# EAGLE design Challenger-2040 (EAGLE 9.6.2)
COMPANY: Invector Labs; DRAWN: P. Oldberg; DRGNO: 10/98-00168-1; REV: 0.2

## Sheet 1 of 2
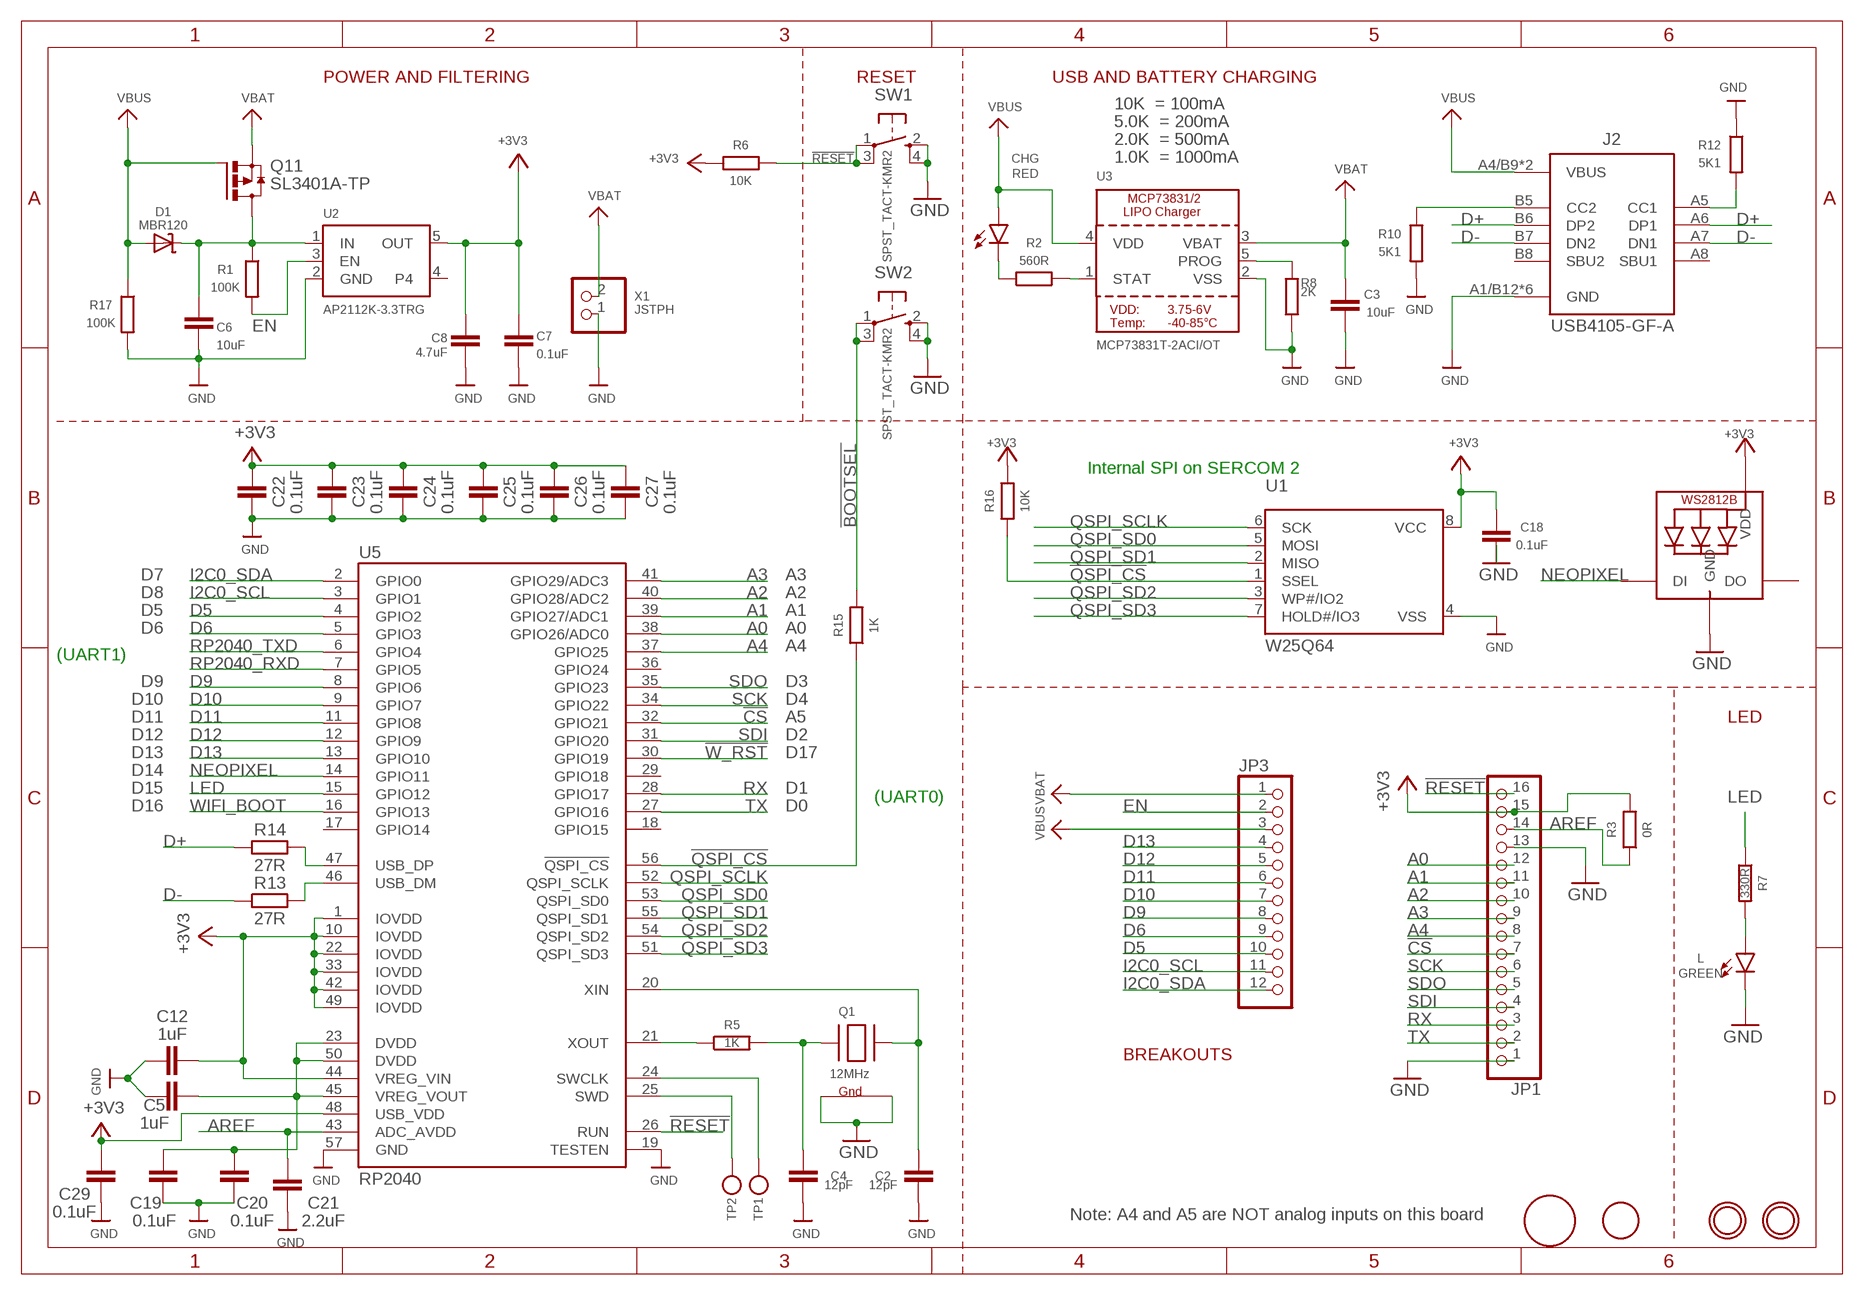
[diagram p0: schematic, sheet 1]

### Parts
C2  12pF  C_CHIP-0402(1005-METRIC)  [CAPC1005X60]
C3  10uF  C_CHIP-0603(1608-METRIC)  [CAPC1608X85]
C4  12pF  C_CHIP-0402(1005-METRIC)  [CAPC1005X60]
C5  1uF  C_CHIP-0402(1005-METRIC)  [CAPC1005X60]
C6  10uF  C_CHIP-0603(1608-METRIC)  [CAPC1608X85]
C7  0.1uF  C_CHIP-0402(1005-METRIC)  [CAPC1005X60]
C8  4.7uF  C_CHIP-0402(1005-METRIC)  [CAPC1005X60]
C12  1uF  C_CHIP-0402(1005-METRIC)  [CAPC1005X60]
C18  0.1uF  C_CHIP-0402(1005-METRIC)  [CAPC1005X60]
C19  0.1uF  C_CHIP-0402(1005-METRIC)  [CAPC1005X60]
C20  0.1uF  C_CHIP-0402(1005-METRIC)  [CAPC1005X60]
C21  2.2uF  C_CHIP-0402(1005-METRIC)  [CAPC1005X60]
C22  0.1uF  C_CHIP-0402(1005-METRIC)  [CAPC1005X60]
C23  0.1uF  C_CHIP-0402(1005-METRIC)  [CAPC1005X60]
C24  0.1uF  C_CHIP-0402(1005-METRIC)  [CAPC1005X60]
C25  0.1uF  C_CHIP-0402(1005-METRIC)  [CAPC1005X60]
C26  0.1uF  C_CHIP-0402(1005-METRIC)  [CAPC1005X60]
C27  0.1uF  C_CHIP-0402(1005-METRIC)  [CAPC1005X60]
C29  0.1uF  C_CHIP-0402(1005-METRIC)  [CAPC1005X60]
CHG  RED  LEDCHIPLED_0603  [CHIPLED_0603]
D1  MBR120  DIODE-SCHOTTKYSOD-123  [SOD-123]
J2  USB4105-GF-A  [GCT_USB4105-GF-A]
JP1  HEADER-1X16ROUND  [1X16_ROUND]
JP3  HEADER-1X12  [1X12_ROUND]
L  GREEN  LEDCHIPLED_0603  [CHIPLED_0603]
LED1  SK6812MINI-B  WS2812B3535  [LED3535]
LOGO1  CHALENGER-11MM  [CHALLENGER]
Q1  12MHz  XTAL-4-3225  [NX3225]
Q11  SL3401A-TP  FDN360P  [SUPER-SOT3]
R1  100K  R_CHIP-0402(1005-METRIC)  [RESC1005X40]
R2  560R  R_CHIP-0402(1005-METRIC)  [RESC1005X40]
R3  0R  R_CHIP-0402(1005-METRIC)  [RESC1005X40]
R5  1K  R_CHIP-0402(1005-METRIC)  [RESC1005X40]
R6  10K  R_CHIP-0402(1005-METRIC)  [RESC1005X40]
R7  330R  R_CHIP-0402(1005-METRIC)  [RESC1005X40]
R8  2K  R_CHIP-0402(1005-METRIC)  [RESC1005X40]
R10  5K1  R_CHIP-0402(1005-METRIC)  [RESC1005X40]
R12  5K1  R_CHIP-0402(1005-METRIC)  [RESC1005X40]
R13  27R  R_CHIP-0402(1005-METRIC)  [RESC1005X40]
R14  27R  R_CHIP-0402(1005-METRIC)  [RESC1005X40]
R15  1K  R_CHIP-0402(1005-METRIC)  [RESC1005X40]
R16  10K  R_CHIP-0402(1005-METRIC)  [RESC1005X40]
R17  100K  R_CHIP-0402(1005-METRIC)  [RESC1005X40]
SW1  SPST_TACT-KMR2  [KMR2]
SW2  SPST_TACT-KMR2  [KMR2]
TP1  TESTPOINTROUND1.5MM  [TESTPOINT_ROUND_1.5MM]
TP2  TESTPOINTROUND1.5MM  [TESTPOINT_ROUND_1.5MM]
U1  W25Q64  SPIFLASH_SOIC8208MIL  [SOIC8_208MIL]
U2  AP2112K-3.3TRG  VREG_SOT23-5  [SOT23-5]
U3  MCP73831T-2ACI/OT  MCP73831/2  [SOT23-5]
U5  RP2040  [QFN40P700X700X90-57T310N]
U$11  CHAL-TEXT  [CHAL-TEXT]
U$31  MOUNTINGHOLE2.5  [MOUNTINGHOLE_2.5_PLATED]
U$32  MOUNTINGHOLE2.5  [MOUNTINGHOLE_2.5_PLATED]
X1  JSTPH  CON_JST_PH_2PIN  [JSTPH2]

### Nets
!BOOTSEL: R15.2 SW2.1(P) SW2.3(P1)
!CS: JP1.7 U5.32(GPIO21)
!QSPI_CS: R15.1 R16.2 U1.1(SSEL) U5.56(!QSPI_CS)
!RESET: JP1.16 R6.1 SW1.1(P) SW1.3(P1) U5.26(RUN)
!W_RST: U5.30(GPIO19) ; also sheet 2
+3V3: C7.1 C8.1 C12.2 C18.1 C22.2 C23.2 C24.2 C25.2 C26.2 C27.2 C29.2 JP1.15 LED1.2(VDD) R3.2 R6.2 R16.1 U1.8(VCC) U2.5(OUT) U5.1(IOVDD) U5.10(IOVDD) U5.22(IOVDD) U5.33(IOVDD) U5.42(IOVDD) U5.44(VREG_VIN) U5.48(USB_VDD) U5.49(IOVDD) ; also sheet 2
A0: JP1.12 U5.38(GPIO26/ADC0)
A1: JP1.11 U5.39(GPIO27/ADC1)
A2: JP1.10 U5.40(GPIO28/ADC2)
A3: JP1.9 U5.41(GPIO29/ADC3)
A4: JP1.8 U5.37(GPIO25)
AREF: C21.2 JP1.14 R3.1 U5.43(ADC_AVDD)
D5: JP3.10 U5.4(GPIO2)
D6: JP3.9 U5.5(GPIO3)
D9: JP3.8 U5.8(GPIO6)
D10: JP3.7 U5.9(GPIO7)
D11: JP3.6 U5.11(GPIO8)
D12: JP3.5 U5.12(GPIO9)
D13: JP3.4 U5.13(GPIO10)
D+: J2.A6(DP1) J2.B6(DP2) R14.1
D-: J2.A7(DN1) J2.B7(DN2) R13.1
EN: JP3.2 R1.2 U2.3(EN)
GND: C2.2 C3.2 C4.2 C5.1 C6.2 C7.2 C8.2 C12.1 C18.2 C19.1 C20.1 C21.1 C22.1 C23.1 C24.1 C25.1 C26.1 C27.1 C29.1 J2.A1/B12(GND) J2.B1/A12(GND) J2.G1(GND) J2.G2(GND) J2.G3(GND) J2.G4(GND) JP1.1 JP1.13 L.C LED1.4(GND) Q1.2(G2) Q1.4(G1) R8.2 R10.2 R12.1 R17.2 SW1.2(S) SW1.4(S1) SW2.2(S) SW2.4(S1) U1.4(VSS) U2.2(GND) U3.2(VSS) U5.19(TESTEN) U5.57(GND) X1.1 ; also sheet 2
I2C0_SCL: JP3.11 U5.3(GPIO1)
I2C0_SDA: JP3.12 U5.2(GPIO0)
LED: R7.1 U5.15(GPIO12)
N$1: CHG.C R2.1
N$2: L.A R7.2
N$3: R2.2 U3.1(STAT)
N$4: R8.1 U3.5(PROG)
N$5: R13.2 U5.46(USB_DM)
N$7: R14.2 U5.47(USB_DP)
N$11: J2.B5(CC2) R10.1
N$12: J2.A5(CC1) R12.2
N$13: C2.1 Q1.3(X2) U5.20(XIN)
N$14: TP1.P$1 U5.24(SWCLK)
N$15: TP2.P$1 U5.25(SWD)
N$16: C4.1 Q1.1(X1) R5.2
N$17: R5.1 U5.21(XOUT)
N$18: C5.2 C19.2 C20.2 U5.23(DVDD) U5.45(VREG_VOUT) U5.50(DVDD)
N$20: C6.1 D1.C Q11.3(D) R1.1 U2.1(IN)
NEOPIXEL: LED1.1(DI) U5.14(GPIO11)
QSPI_SCLK: U1.6(SCK) U5.52(QSPI_SCLK)
QSPI_SD0: U1.5(MOSI) U5.53(QSPI_SD0)
QSPI_SD1: U1.2(MISO) U5.55(QSPI_SD1)
QSPI_SD2: U1.3(WP#/IO2) U5.54(QSPI_SD2)
QSPI_SD3: U1.7(HOLD#/IO3) U5.51(QSPI_SD3)
RP2040_RXD: U5.7(GPIO5) ; also sheet 2
RP2040_TXD: U5.6(GPIO4) ; also sheet 2
RX: JP1.3 U5.28(GPIO17)
SCK: JP1.6 U5.34(GPIO22)
SDI: JP1.4 U5.31(GPIO20)
SDO: JP1.5 U5.35(GPIO23)
TX: JP1.2 U5.27(GPIO16)
VBAT: C3.1 JP3.1 Q11.2(S) U3.3(VBAT) X1.2
VBUS: CHG.A D1.A J2.A4/B9(VBUS) J2.B4/A9(VBUS) JP3.3 Q11.1(G) R17.1 U3.4(VDD)
WIFI_BOOT: U5.16(GPIO13) ; also sheet 2
Unconnected: J2.A8(SBU1) J2.B8(SBU2) LED1.3(DO) U2.4 U5.17(GPIO14) U5.18(GPIO15) U5.29(GPIO18) U5.36(GPIO24)

### Notes on the sheet
- POWER AND FILTERING | RESET | USB AND BATTERY CHARGING
- 10K  = 100mA
- 5.0K  = 200mA
- 2.0K  = 500mA
- 1.0K  = 1000mA
- Internal SPI on SERCOM 2
- D7 | A3
- D8 | A2
- D5 | A1
- D6 | A0
- A4
- (UART1)
- D9 | D3
- D10 | D4
- D11 | A5 | LED
- D12 | D2
- D13 | D17
- D14
- D15 | D1
- (UART0)
- D16 | D0
- BREAKOUTS
- Note: A4 and A5 are NOT analog inputs on this board

## Sheet 2 of 2
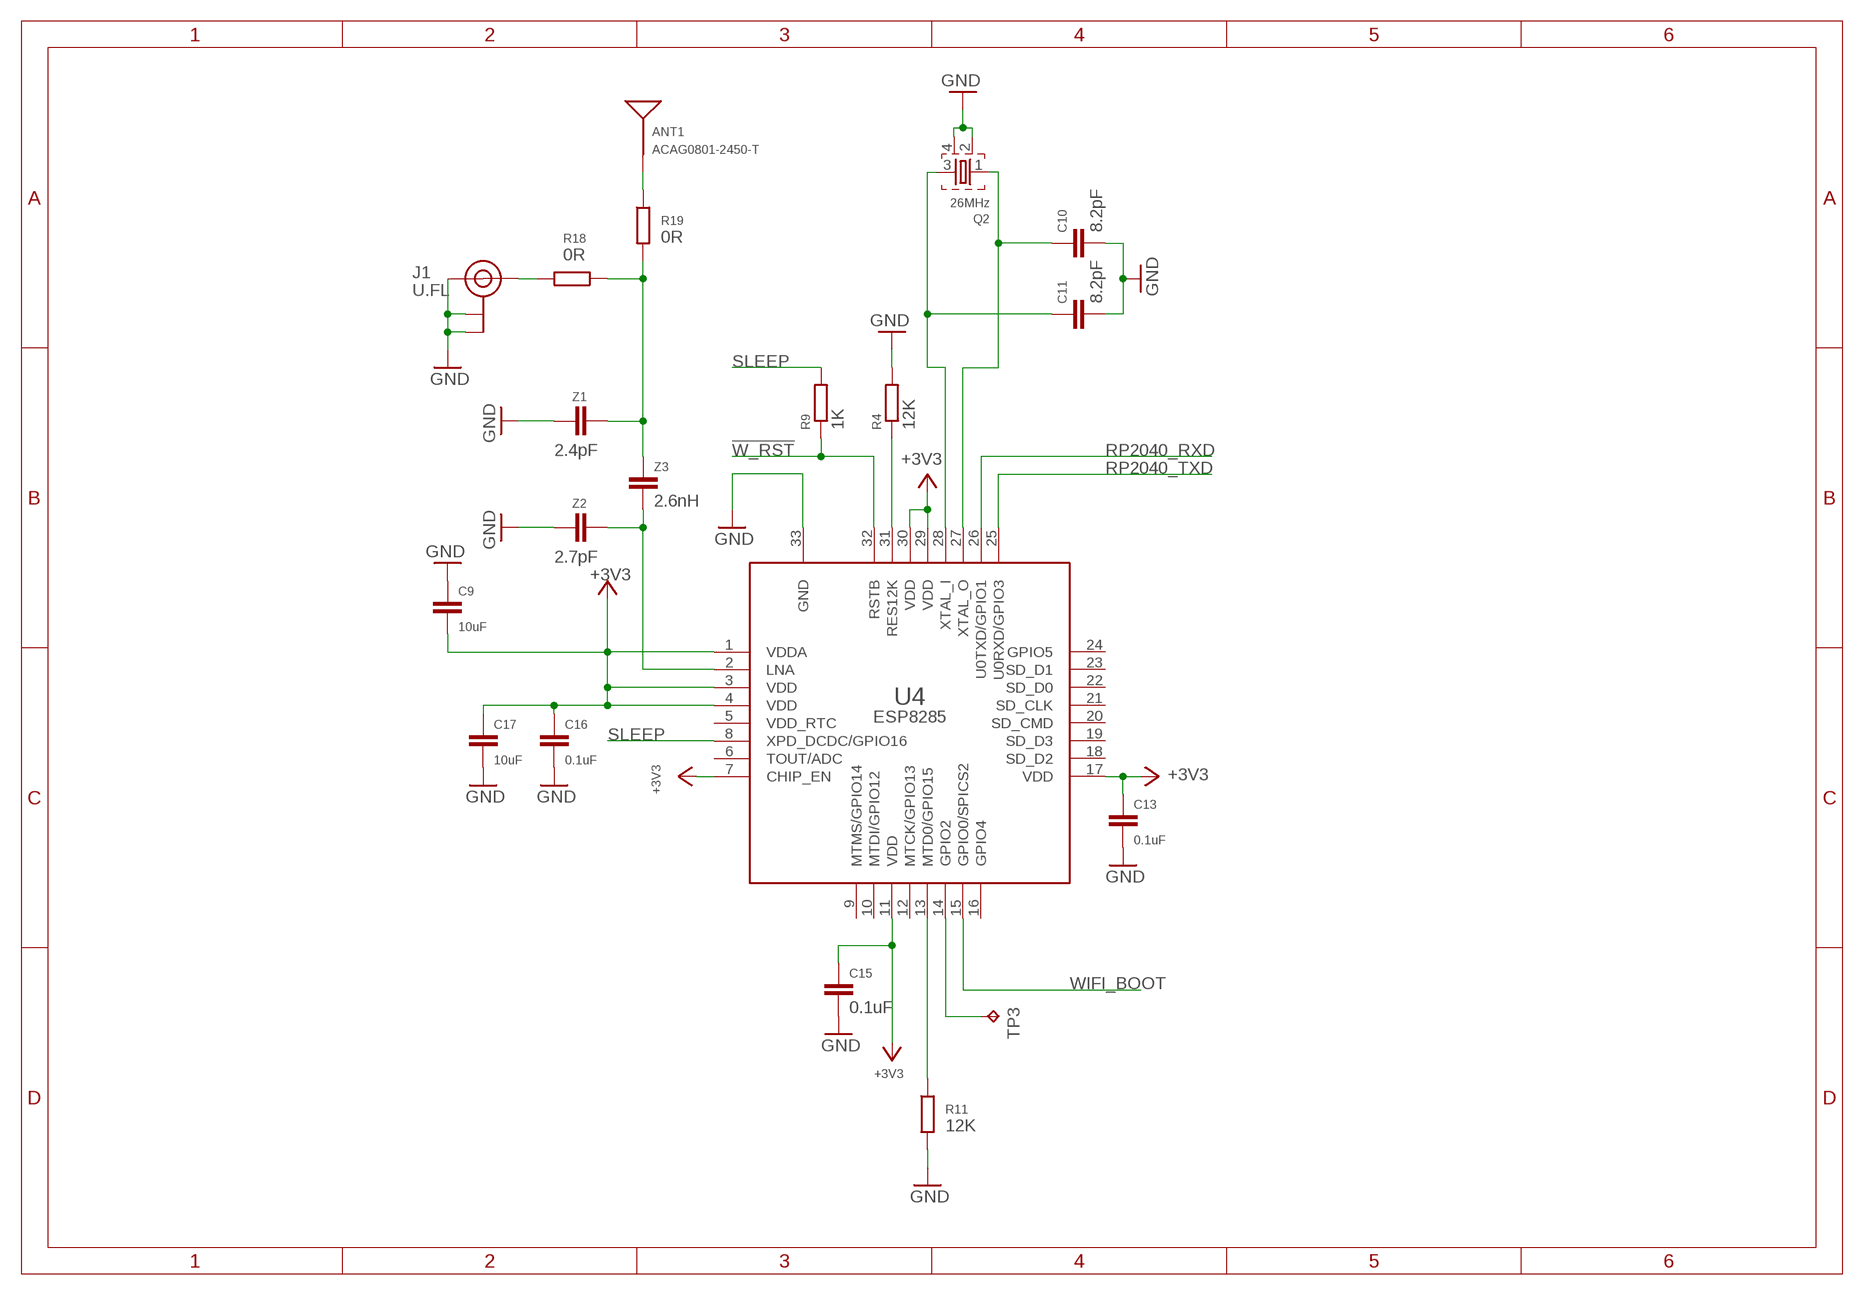
[diagram p1: schematic, sheet 2]

### Parts
ANT1  ACAG0801-2450-T  ANTENNA2SMD6  [ANTENNA-CHIP6]
C9  10uF  C_CHIP-0603(1608-METRIC)  [CAPC1608X85]
C10  8.2pF  C_CHIP-0402(1005-METRIC)  [CAPC1005X60]
C11  8.2pF  C_CHIP-0402(1005-METRIC)  [CAPC1005X60]
C13  0.1uF  C_CHIP-0402(1005-METRIC)  [CAPC1005X60]
C15  0.1uF  C_CHIP-0402(1005-METRIC)  [CAPC1005X60]
C16  0.1uF  C_CHIP-0402(1005-METRIC)  [CAPC1005X60]
C17  10uF  C_CHIP-0603(1608-METRIC)  [CAPC1608X85]
J1  U.FL  [U.FL]
Q2  26MHz  FA-128  [FA-128]
R4  12K  R_CHIP-0402(1005-METRIC)  [RESC1005X40]
R9  1K  R_CHIP-0402(1005-METRIC)  [RESC1005X40]
R11  12K  R_CHIP-0402(1005-METRIC)  [RESC1005X40]
R18  0R  R_CHIP-0402(1005-METRIC)  [RESC1005X40]
R19  0R  R_CHIP-0402(1005-METRIC)  [RESC1005X40]
TP3  TPB1,27  [B1,27]
U4  ESP8285  ESP8266EXT  [SLP32]
Z1  2.4pF  C_CHIP-0402(1005-METRIC)  [CAPC1005X60]
Z2  2.7pF  C_CHIP-0402(1005-METRIC)  [CAPC1005X60]
Z3  2.6nH  C_CHIP-0402(1005-METRIC)  [CAPC1005X60]

### Nets
!W_RST: R9.1 U4.32(RSTB) ; also sheet 1
+3V3: C9.2 C13.1 C15.1 C16.1 C17.1 U4.1(VDDA) U4.3(VDD) U4.4(VDD) U4.7(CHIP_EN) U4.11(VDD) U4.17(VDD) U4.29(VDD) U4.30(VDD) ; also sheet 1
GND: C9.1 C10.2 C11.2 C13.2 C15.2 C16.2 C17.2 J1.P$1(GND) J1.P$2(GND) J1.P$4(PT) Q2.2 Q2.4 R4.2 R11.2 U4.33(GND) Z1.1 Z2.1 ; also sheet 1
N$6: R4.1 U4.31(RES12K)
N$8: C10.1 Q2.1 U4.27(XTAL_O)
N$9: TP3.TP U4.14(GPIO2)
N$10: C11.1 Q2.3 U4.28(XTAL_I)
N$19 [RF]: J1.P$3(SIGNAL) R18.2
N$21 [RF]: ANT1.1(SIGNAL) R19.1
N$123: R11.1 U4.13(MTD0/GPIO15)
RF1 [RF]: U4.2(LNA) Z2.2 Z3.2
RF2 [RF]: R18.1 R19.2 Z1.2 Z3.1
RP2040_RXD: U4.26(U0TXD/GPIO1) ; also sheet 1
RP2040_TXD: U4.25(U0RXD/GPIO3) ; also sheet 1
SLEEP: R9.2 U4.8(XPD_DCDC/GPIO16)
WIFI_BOOT: U4.15(GPIO0/SPICS2) ; also sheet 1
Unconnected: U4.5(VDD_RTC) U4.6(TOUT/ADC) U4.9(MTMS/GPIO14) U4.10(MTDI/GPIO12) U4.12(MTCK/GPIO13) U4.16(GPIO4) U4.18(SD_D2) U4.19(SD_D3) U4.20(SD_CMD) U4.21(SD_CLK) U4.22(SD_D0) U4.23(SD_D1) U4.24(GPIO5)

## Library data of the parts
ANT1 = SparkFun-RF:ANTENNA2: Chip antenna Single endded antenna. Common with smaller chip antennas. CHIP4 package is the GPS Chip Antenna SKU: GPS-08418. CHIP5 package is 2.4GHz chip antenna SKU: WRL-00144.
C2-C13 C15-C27 C29 Z1-Z3 = Capacitor:C: Capacitor - Generic; CATEGORY: Capacitor
CHG L = new_led:LED: LED OSRAM: - CHIPLED LG R971, LG N971, LY N971, LG Q971, LY Q971, LO R971, LY R971 LH N974, LH R974 LS Q976, LO Q976, LY Q976 LO Q996 - Hyper CHIPLED LW Q18S LB Q993, LB Q99A, LB R99A - SideLED LS A670, LO A670, LY A670, LG A670, LP A670 LB A673, LV A673, LT A673, LW A673 LH A674 LY A675 LS A676, LA A676, LO A676, LY A676, LW A676 LS A679, LY A679, LG A679 - Hyper Micro SIDELED® LS Y876, LA Y876, LO Y876, LY Y876 LT Y87S - SmartLED LW L88C, LW L88S LB L89C, LB L89S, LG L890 LS L89K, LO L89K, LY L89K LS L896, LA L896, LO L896, LY L896 - TOPLED LS T670, LO T670, LY T670, LG T670, LP T670 LSG T670, LSP T670, LSY T670, LOP T670, LYG T670 LG T671, LOG T671, LSG T671 LB T673, LV T673, LT T673, LW T673 LH T674 LS T676, LA T676, LO T676, LY T676, LB T676, LH T676, LSB T676, LW T676 LB T67C, LV T67C, LT T67C, LS T67K, LO T67K, LY T67K, LW E67C LS E67B, LA E67B, LO E67B, LY E67B, LB E67C, LV E67C, LT E67C LW T67C LS T679, LY T679, LG T679 LS T770, LO T770, LY T770, LG T770, LP T770 LB T773, LV T773, LT T773, LW T773 LH T774 LS E675, LA E675, LY E675, LS T675 LS T776, LA T776, LO T776, LY T776, LB T776 LHGB T686 LT T68C, LB T68C - Hyper Mini TOPLED® LB M676 - Mini TOPLED Santana® LG M470 LS M47K, LO M47K, LY M47K Source: http://www.osram.convergy.de LUXEON: - LUMILED® LXK2-PW12-R00, LXK2-PW12-S00, LXK2-PW14-U00, LXK2-PW14-V00 LXK2-PM12-R00, LXK2-PM12-S00, LXK2-PM14-U00 LXK2-PE12-Q00, LXK2-PE12-R00, LXK2-PE12-S00, LXK2-PE14-T00, LXK2-PE14-U00 LXK2-PB12-K00, LXK2-PB12-L00, LXK2-PB12-M00, LXK2-PB14-N00, LXK2-PB14-P00, LXK2-PB14-Q00 LXK2-PR12-L00, LXK2-PR12-M00, LXK2-PR14-Q00, LXK2-PR14-R00 LXK2-PD12-Q00, LXK2-PD12-R00, LXK2-PD12-S00 LXK2-PH12-R00, LXK2-PH12-S00 LXK2-PL12-P00, LXK2-PL12-Q00, LXK2-PL12-R00 Source: www.luxeon.com KINGBRIGHT: KA-3528ASYC Source: www.kingbright.com
D1 = Challenger-2040:DIODE-SCHOTTKY
J1 = Used-Connectors:U.FL: SMD antenna connector- WRL-09144
J2 = USB4105-GF-A:USB4105-GF-A: USB Type C Receptacle for USB 2.0 SMT Type, PCB Top Mount; AVAILABILITY: Unavailable; DESCRIPTION: USB-C (USB TYPE-C) USB 2.0 Receptacle Connector 24 (16+8 Dummy) Position Surface Mount, Right Angle; Through Hole; MF: GCT; MP: USB4105-GF-A; PACKAGE: None; PRICE: None
JP1 = microbuilder:HEADER-1X16: PIN HEADER
JP3 = microbuilder:HEADER-1X12
LED1 = microbuilder:WS2812B
LOGO1 = ilabs-pictures:CHALENGER-11MM
Q1 = adafruit:XTAL-4: Classic 4-pin 3.2 x 2.5mm crystal
Q2 = crystal:FA-: MHz RANGE CRYSTAL UNIT Source: Epson Toyocom
Q11 = transistor-power:FDN360P: Single P-Channel, PowerTrench (R) MOSFET Source: http://www.fairchildsemi.com/ds/FD/FDN360P.pdf
R1-R19 = Resistor:R: Resistor Fixed - Generic; CATEGORY: Resistor; SUB-CATEGORY: Fixed
SW1 SW2 = adafruit:SPST_TACT: SMT 6mm switch, EVQQ2 series http://www.ladyada.net/library/eagle
TP1 TP2 = microbuilder:TESTPOINT: Test Point Various test points for characterisation and PCB testing TESTPOINT_SMT - Compact Surface Mount Test Point [Digikey: 5016KTR-ND]
TP3 = testpad:TP: Test pad
U1 = microbuilder:SPIFLASH_SOIC8: SOIC8 SPI Flash Be careful with the size since SOIC8 flash comes in several 'widths' SOIC8 150 mil M25P16 - 16Mbit (2Mbit x 8) Serial Flash (75MHz SPI Bus), Supply: 2.7-3.6V Digikey: SOIC8 - M25P16-VMN6P-ND SOIC8 208 mil W25Q16BVSSIG - 16Mbit (2Mbit x 8) Serial Flash (104MHz SPI Bus), Supply: 2.7-3.6V Digikey: SOIC8 - W25Q16BVSSIG-ND
U2 = microbuilder:VREG_SOT23-5: SOT23-5 Fixed Voltage Regulators Part Current Out V Out V In V Dropout θJA (°C/W) TJ (°C) Digikey Part No. ADP121 150mA 3.3V 3.4-5.5V 0.09V @ 150mA -- -- ADP121-AUJZ33R7CT-ND ADP121 150mA 3.0V 3.1-5.5V 0.09V @ 150mA -- -- ADP121-AUJZ30R7CT-ND ADP122 300mA 3.3V 3.4-5.5V 0.085V @ 300mA -- -- ADP122AUJZ-3.3-R7CT-ND ADP1712 300mA 3.3V 3.5-5.5V 0.17V @ 300mA -- -- ADP1712AUJZ-3.3-R7TR-ND AP7311 (Low Cost) 150mA 3.3V 3.5-6V 0.15V @ 150mA -- -- AP7311-33WG-7DICT-ND LD39015M18R 150mA 1.8V 1.9V-5.5V 0.08V @ 100mA -- -- 497-6977-1-ND LP2985A-33DBVR 150mA 3.3V 3.3-16V 0.28V @ 150mA 206 150 296-18479-1-ND MCP1824T-3302E/OT 300mA 3.3V 3.5V-6V 0.2V @ 300mA -- -- MCP1824T-3302E/OTCT-ND MIC5205-2.5YM5 TR 150mA 2.5V 2.7-16V 0.165V @ 150mA -- -- 576-1257-2-ND MIC5205-3.0YM5 TR 150mA 3.0V 3.2V-16V 0.165V @ 150mA -- -- 576-1258-2-ND MIC5205-3.3YM5 TR 150mA 3.3V 3.5V-16V 0.165V @ 150mA -- -- 576-1259-2-ND TPS780330220 150mA 3.3V+2.2V 3.6-5.5V 250mV Max -- -- 296-23332-1-ND TDA3663/N1,135 100mA 3.3V 3.5-45V 0.18V @ 50mA -- -- 568-5343-1-ND Max operating temp can be calculated using θJA, TJ (max junction temperature), and power in watts. Set the "Maximum Ambient Temperature" until it reaches TJ ("Max Junction Temperature"), which is the absolute limit for safe use of the regulator: Heat Sink Temperature Calculator <http://www.daycounter.com/Calculators/Heat-Sink-Temperature-Calculator.phtml> For example, With 12V source into a 3.3V LP2985 and a 30mA load, we are dissipating (12V-3.3V) * 0.03A = 0.261W. With a θJA of 206 °C/W, a TJ of 150°C, and 261mW we can safely use the chip without a heat sink up to 75°C (=147.1°C Junction Temperature).
U3 = microbuilder:MCP73831/2: MCP73831/2 LIPO Charger VDD: 3.75 - 6V Temp -40 - 85°C Programmable Charge Rate: 15-500mA NOTE: STAT is a tri-state logic output on the MCP73831 and an open-drain output on the MCP73832. SOT23-5 with 4.2V output and tri-state logic on STAT = MCP73831T-2ACI/OT
U4 = espressif:ESP8266EX
U5 = raspberrypi:RP2040
U$11 = ilabs-pictures:CHAL-TEXT
U$31 U$32 = microbuilder:MOUNTINGHOLE: Mounting Hole For #2 screws (0.086"/2.18mm width, 0.094"/2.4mm hole) use 2.5mm; BOM: EXCLUDE
X1 = microbuilder:CON_JST_PH_2PIN: JST 2-Pin Right-Angle Connector PH-Series - 4UConnector: 17311 SH-Series - 4UConnector: 07278

## Net classes
1 RF: width 0.6 mm, clearance 0.15 mm

## Board
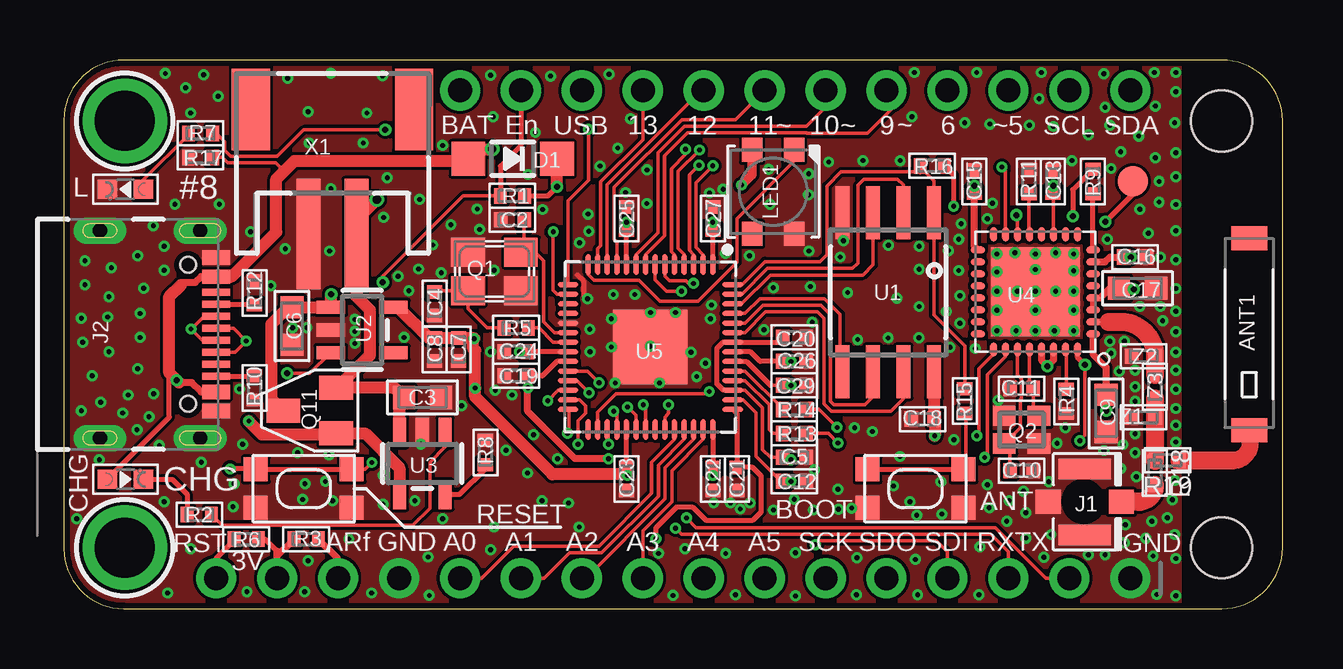
[diagram p2: board, top side]
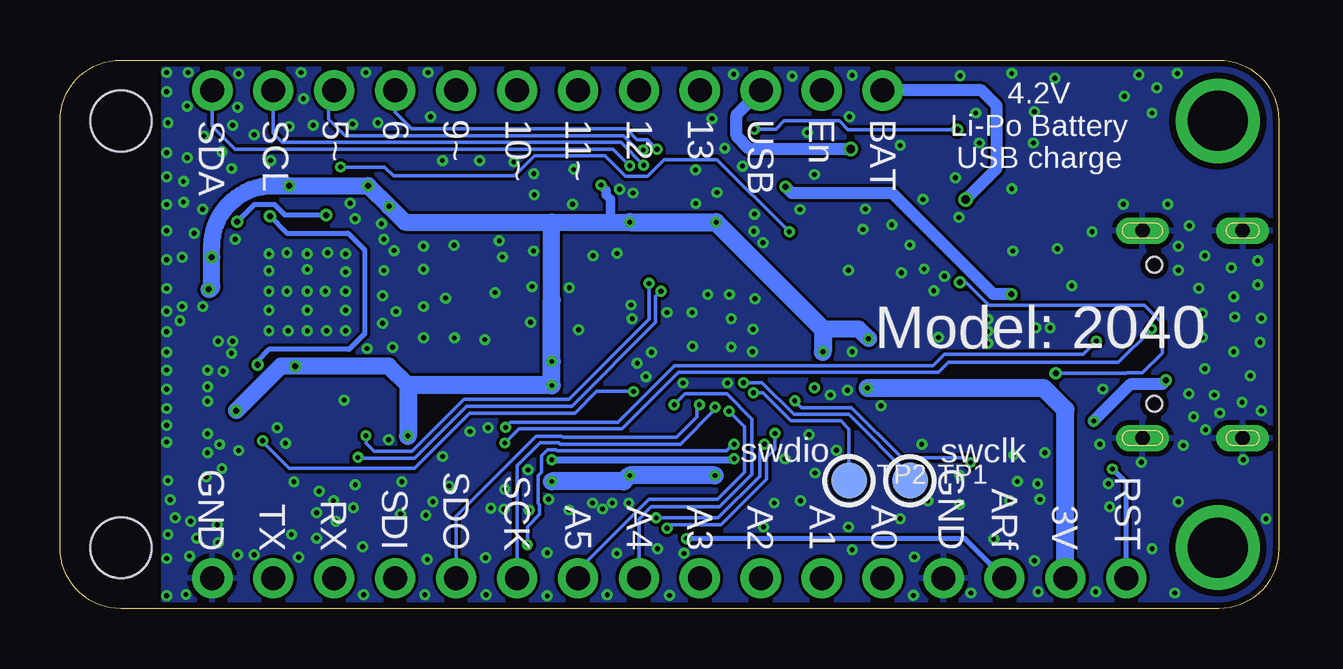
[diagram p3: board, bottom side, seen from below]

Size 50.8 x 22.86 mm. Coordinates in mm from the lower left corner, seen from the top.
Outline: 0,20.36 0,2.5 arc90 2.5,0 48.26,0 arc90 50.8,2.54 50.8,20.32 arc90 48.26,22.86 2.5,22.86 arc90 0,20.36
Copper layers (1*16): Top 0.035mm / dielectric 1.5mm / Bottom 0.035mm
Design rules "adafruit *": minimum track width 5mil, minimum drill 0.2mm, track to track 5mil, track to pad 5mil, pad to pad 5mil, via to via 5mil, smd to smd 5mil, copper to edge 10mil, drill to drill 8mil, minimum pad ring 10mil, minimum via ring 5mil, stop-mask expansion 2mil, vias tented up to drill 0.3mm, thermal gap 8mil
Holes 2.54 mm at 48.26,20.32 48.26,2.54
tRestrict: area 35.4,15.3 to 35.9,15.6; area 34.1,15.4 to 34.5,15.6; area 34.1,10.8 to 34.5,11; area 32.9,10.8 to 33.3,10.9

### Footprints (pad centres in the part's own frame; a part is rotated, then mirrored left to right if it is on the bottom)
ANTENNA-CHIP6 = smd 1 x 1.5: 1 -4,0; NC 4,0
CAPC1005X60 = smd 0.56 x 0.629: 1 -0.485,0; 2 0.485,0
CAPC1608X85 = smd 0.921 x 0.97: 1 -0.775,0; 2 0.775,0
CHIPLED_0603 = smd 0.8 x 0.8: A 0,-0.75; C 0,0.75
SOD-123 = smd 1.4 x 1.4: A 1.85,0; C -1.85,0
U.FL = smd 2.2 x 0.85: P$1 0,1.375; P$2 0,-1.375 | smd 1.05 x 1: P$3 1.525,0; P$4 -1.525,0
GCT_USB4105-GF-A = smd 0.6 x 1.15: A1/B12 -3.2,4.85; A4/B9 -2.4,4.85; B1/A12 3.2,4.85; B4/A9 2.4,4.85 | smd 0.3 x 1.15: A5 -1.25,4.85; A6 -0.25,4.85; A7 0.25,4.85; A8 1.25,4.85; B5 1.75,4.85; B6 0.75,4.85; B7 -0.75,4.85; B8 -1.75,4.85 | drill 0.6 pad 1 long: G1 -4.32,0; G2 4.32,0 | drill 0.6 pad 1.05 long: G3 -4.32,4.18; G4 4.32,4.18 | hole 0.65: 2.89,3.68; -2.89,3.68
1X16_ROUND = drill 1 pad 1.676: 1 -19.05,0; 2 -16.51,0; 3 -13.97,0; 4 -11.43,0; 5 -8.89,0; 6 -6.35,0; 7 -3.81,0; 8 -1.27,0; 9 1.27,0; 10 3.81,0; 11 6.35,0; 12 8.89,0; 13 11.43,0; 14 13.97,0; 15 16.51,0; 16 19.05,0
1X12_ROUND = drill 1 pad 1.676: 1 -13.97,0; 2 -11.43,0; 3 -8.89,0; 4 -6.35,0; 5 -3.81,0; 6 -1.27,0; 7 1.27,0; 8 3.81,0; 9 6.35,0; 10 8.89,0; 11 11.43,0; 12 13.97,0
LED3535 = smd 1 x 0.85: 1 -1.75,0.875; 2 -1.75,-0.875; 3 1.75,-0.875; 4 1.75,0.875
NX3225 = smd 1.4 x 1.2: 1 -1.1,-0.8; 2 1.1,-0.8; 3 1.1,0.8; 4 -1.1,0.8
FA-128 = smd 0.95 x 0.85: 1 -0.725,-0.575; 2 0.725,-0.575; 3 0.725,0.575; 4 -0.725,0.575
SUPER-SOT3 = smd 1 x 1.4: 1 -0.95,-1.1; 2 0.95,-1.1; 3 0,1.1
RESC1005X40 = smd 0.535 x 0.644: 1 -0.507,0; 2 0.507,0
KMR2 = smd 1 x 1: 1 2,0.8; 2 2,-0.8; 3 -2,0.8; 4 -2,-0.8
TESTPOINT_ROUND_1.5MM = smd 1.5 x 1.5: P$1 0,0
B1,27 = smd 1.27 x 1.27: TP 0,0
SOIC8_208MIL = smd 0.6 x 2.2: 1 -1.905,-3.315; 2 -0.635,-3.315; 3 0.635,-3.315; 4 1.905,-3.315; 5 1.905,3.315; 6 0.635,3.315; 7 -0.635,3.315; 8 -1.905,3.315
SOT23-5 = smd 0.55 x 1.2: 1 -0.95,-1.3; 2 0,-1.3; 3 0.95,-1.3; 4 0.95,1.3; 5 -0.95,1.3
SLP32 = smd 0.6 x 0.3: 1 -2.4,1.75; 2 -2.4,1.25; 3 -2.4,0.75; 4 -2.4,0.25; 5 -2.4,-0.25; 6 -2.4,-0.75; 7 -2.4,-1.25; 8 -2.4,-1.75; 17 2.4,-1.75; 18 2.4,-1.25; 19 2.4,-0.75; 20 2.4,-0.25; 21 2.4,0.25; 22 2.4,0.75; 23 2.4,1.25; 24 2.4,1.75 | smd 0.3 x 0.6: 9 -1.75,-2.4; 10 -1.25,-2.4; 11 -0.75,-2.4; 12 -0.25,-2.4; 13 0.25,-2.4; 14 0.75,-2.4; 15 1.25,-2.4; 16 1.75,-2.4; 25 1.75,2.4; 26 1.25,2.4; 27 0.75,2.4; 28 0.25,2.4; 29 -0.25,2.4; 30 -0.75,2.4; 31 -1.25,2.4; 32 -1.75,2.4 | smd 3.7 x 3.7: 33 0,0
QFN40P700X700X90-57T310N = smd 0.86 x 0.2: 1 -3.435,2.6; 2 -3.435,2.2; 3 -3.435,1.8; 4 -3.435,1.4; 5 -3.435,1; 6 -3.435,0.6; 7 -3.435,0.2; 8 -3.435,-0.2; 9 -3.435,-0.6; 10 -3.435,-1; 11 -3.435,-1.4; 12 -3.435,-1.8; 13 -3.435,-2.2; 14 -3.435,-2.6; 29 3.435,-2.6; 30 3.435,-2.2; 31 3.435,-1.8; 32 3.435,-1.4; 33 3.435,-1; 34 3.435,-0.6; 35 3.435,-0.2; 36 3.435,0.2; 37 3.435,0.6; 38 3.435,1; 39 3.435,1.4; 40 3.435,1.8; 41 3.435,2.2; 42 3.435,2.6 | smd 0.2 x 0.86: 15 -2.6,-3.435; 16 -2.2,-3.435; 17 -1.8,-3.435; 18 -1.4,-3.435; 19 -1,-3.435; 20 -0.6,-3.435; 21 -0.2,-3.435; 22 0.2,-3.435; 23 0.6,-3.435; 24 1,-3.435; 25 1.4,-3.435; 26 1.8,-3.435; 27 2.2,-3.435; 28 2.6,-3.435; 43 2.6,3.435; 44 2.2,3.435; 45 1.8,3.435; 46 1.4,3.435; 47 1,3.435; 48 0.6,3.435; 49 0.2,3.435; 50 -0.2,3.435; 51 -0.6,3.435; 52 -1,3.435; 53 -1.4,3.435; 54 -1.8,3.435; 55 -2.2,3.435; 56 -2.6,3.435 | smd 3.1 x 3.1: 57 0,0
MOUNTINGHOLE_2.5_PLATED = drill 2.5 pad 3.2: P$1 0,0
JSTPH2 = smd 1 x 4.6: 1 -1,-3.7; 2 1,-3.7 | smd 1.6 x 3.4: NC1 -3.4,1.5; NC2 3.4,1.5

### Placement (x,y rotation side)
ANT1  49.4,11.43 90 top
C2  18.7,16.2 180 top
C3  14.95,8.8 0 top
C4  15.45,12.71 270 top
C5  30.45,6.3 180 top
C6  9.51,11.78 270 top
C7  16.45,10.8 270 top
C8  15.45,10.8 270 top
C9  43.44,8.14 90 top
C10  39.92,5.75 0 top
C11  39.92,9.17 180 top
C12  30.45,5.3 180 top
C13  41.23,17.8 90 top
C15  37.95,17.8 90 top
C16  44.65,14.65 0 top
C17  44.75,13.35 0 top
C18  35.8,7.9 180 top
C19  18.85,9.7 0 top
C20  30.45,11.3 180 top
C21  28.05,5.4 90 top
C22  27.05,5.4 90 top
C23  23.45,5.4 90 top
C24  18.85,10.7 0 top
C25  23.45,16.25 270 top
C26  30.45,10.3 180 top
C27  27.05,16.25 270 top
C29  30.45,9.3 180 top
CHG  2.56,5.39 270 top
D1  18.7,18.74 180 top
J1  42.55,4.45 0 top
J2  1.5,11.43 270 top
JP1  25.4,1.27 180 top
JP3  30.48,21.59 0 top
L  2.56,17.47 90 top
LED1  29.56,17.37 270 top
LOGO1  44.5,5.45 0 bottom
Q1  17.95,14.05 0 top
Q2  39.92,7.46 0 top
Q11  10.25,8.25 90 top
R1  18.7,17.2 180 top
R2  5.65,3.92 0 top
R3  10.1,2.9 180 top
R4  41.78,8.64 270 top
R5  18.85,11.7 180 top
R6  7.6,2.9 0 top
R7  5.7,19.8 180 top
R8  17.57,6.51 90 top
R9  42.9,17.8 270 top
R10  7.95,9.2 270 top
R11  40.23,17.8 90 top
R12  7.95,13.16 270 top
R13  30.45,7.3 180 top
R14  30.45,8.3 180 top
R15  37.55,8.65 270 top
R16  36.2,18.45 180 top
R17  5.7,18.8 180 top
R18  45.48,5.65 270 top
R19  46,6.17 180 top
SW1  10,5 0 top
SW2  35.5,5 0 top
TP1  15.37,5.33 0 bottom
TP2  17.91,5.33 0 bottom
TP3  44.55,17.8 0 top
U1  34.36,13.18 180 top
U2  12.43,11.61 270 top
U3  14.94,6.05 180 top
U4  40.5,13.2 180 top
U5  24.45,10.9 270 top
U$11  31.3,4.9 31 bottom
U$31  2.54,20.32 270 top
U$32  2.54,2.54 270 top
X1  11.2,19.3 0 top
Z1  45,7.97 0 top
Z2  45,10.52 0 top
Z3  45.48,9.25 90 top

### Tracks (layer width: path | path; a pad name or v marks a point on that pad's centre or on a via)
!BOOTSEL
  Top 0.152: R15.2 37.6,8.09 37.6,5.9 SW2.1
  Top 0.2: SW2.3 SW2.1
!CS  (via drill 0.2)
  Top 0.152: U5.32 23.05,8.09 v22.92,8.22
  Bottom 0.152: v22.92,8.22 22.27,7.57 22.27,5.68 23.4,4.55 26.25,4.55 29.21,1.59 JP1.7
!QSPI_CS
  Top 0.152: U5.56 28.26,13.5 29.22,14.46 31.51,14.46 31.8,14.75 31.8,17.6 32.4,18.2 35.7,18.2 35.9,18.2 36.26,17.84 U1.1 36.26,12.24 37.55,10.95 R15.1
  Top 0.2: R16.2 35.69,18.21 35.7,18.2
!RESET  (via drill 0.2)
  Top 0.152: U5.26 20.61,9.1 v20.17,8.67 | v12.84,6.09 12.55,5.8 SW1.1
  Top 0.2: 7.99,5.82 v6.93,5.82 | SW1.3 SW1.1 | R6.1 7.09,2.85 6.35,2.11 JP1.16
  Top 0.5: SW1.3 7.99,5.82
  Bottom 0.152: v20.17,8.67 19.88,8.38 17.8,8.38 15.71,6.29 13.04,6.29 v12.84,6.09
  Bottom 0.2: JP1.16 6.35,5.24 v6.93,5.82
!W_RST  (via drill 0.2, 0.25)
  Top 0.152: v26.9,9.05 26.8,8.95 23.01,8.95 22.25,8.19 U5.30 | v42.56,10.16 42.56,7.21 v42.35,7
  Top 0.2: R9.1 42.05,17.46 v42.05,16.35 | v42.56,10.16 42.25,10.48 U4.32
  Bottom 0.152: v26.9,9.05 28.43,9.05 29.34,8.14 33.72,8.14 36.01,5.85 41.25,5.85 42.35,6.95
  Bottom 0.2: v42.05,16.35 41.35,15.65 38.8,15.65 38.1,14.95 38.1,11.45 38.75,10.8 42.1,10.8 42.56,10.34 v42.56,10.16 | v42.35,7 42.35,6.95
+3V3  (via drill 0.2, 0.25)
  Top 0.152: C22.2 v27.05,5.55 | C23.2 23.45,5.6 v23.5,5.55 | 36.26,7.92 C18.1 36.3,7.88 | C24.2 v19,10.7 | C25.2 v23.45,16.1 | C26.2 v30.3,10.3 | v30.3,5.3 30.25,5.25 30.02,5.25 C12.2 29.9,5.3 28.84,6.36 28.84,8.16 28.3,8.7 U5.44 | v30.3,9.3 C29.2 29.45,9.3 | C9.2 43.44,8.26 v43.45,8.25 | C16.1 v44.48,14.65 | 43.6,13.35 C17.1 44.55,13.35 v44.6,13.3 | U4.11 41.25,17.29 C13.1 41.23,17.6 v41.25,17.63 | C15.1 v37.95,17.63
  Top 0.2: U5.42 C22.2 | C23.2 U5.33 | U5.22 C24.2 | U5.10 C25.2 | C26.2 29.02,10.3 28.61,10.7 U5.49 | U5.1 27.05,15.65 C27.2 | U5.48 28.45,10.3 29.45,9.3 | U4.3 U4.4 | R6.2 8.39,2.9 8.89,2.4 | R16.1 37.09,18.07 v37.09,16.76
  Top 0.3: U4.1 42.9,10.6 43.44,10.06 C9.2 | U4.29 40.75,10.35 v41,10.1 41.25,10.35 U4.30 | U4.7 43.4,14.45 43.6,14.65 C16.1 | U4.4 43.2,12.95 43.6,13.35 | U4.17 37.95,15.1 C15.1 | JP1.15 8.89,2.2 | 8.89,2.2 8.89,2.4 | 8.89,2.2 R3.2 | v27.05,16.1 27.05,15.65
  Top 0.4: LED1.2 28.69,18.09 v28.25,17.65
  Top 0.5: U1.8 36.26,7.92 | 36.3,7.88 v36.3,7.2 | U2.5 13.94,12.56 15.21,11.29 C8.1 C7.1 17.07,11.29 | 17.07,11.29 v17.1,11.25 | 23.45,5.6 20.36,5.6 17.14,8.82 v17.14,9.19 17.14,10.75 17.07,10.83 17.07,11.29
  Bottom 0.4: 27.85,16.1 27.85,17.06 28.03,17.24 28.03,17.43 v28.25,17.65
  Bottom 0.7: v44.6,13.3 arc-90 44.48,13.42 v44.48,14.65 44.48,15.09 arc90 41.94,17.63 v41.25,17.63 v37.95,17.63 v37.09,16.76 36.42,16.1 30.3,16.1 | 30.3,16.1 27.85,16.1 v27.05,16.1 | 30.3,12.85 30.3,16.1 | 36.3,9.3 37.1,10.1 v41,10.1 41.6,10.1 v43.45,8.25 | v17.1,11.25 17.5,11.65 19,11.65
  Bottom 0.75: 30.3,12.85 v30.3,10.3 v30.3,9.3 36.3,9.3 v36.3,7.2 | v27.05,16.1 v23.45,16.1 19,11.65 v19,10.7 | v23.5,5.55 v27.05,5.55 27.3,5.3 v30.3,5.3 | JP1.15 8.89,8.29 9.79,9.19 v17.14,9.19
A0
  Top 0.152: U5.38 25.45,7.05 24.5,6.1 24.5,4.8 22.3,2.6 18.75,2.6 17.42,1.27 JP1.12
A1
  Top 0.152: U5.39 25.85,7.05 24.78,5.98 24.78,4.68 22.42,2.32 21.07,2.32 20.02,1.27 JP1.11
A2
  Top 0.152: U5.40 26.25,7.06 25.06,5.87 25.06,4.57 21.76,1.27 JP1.10
A3
  Top 0.152: U5.41 26.65,7.07 25.34,5.75 25.34,4.45 24.13,3.25 JP1.9
A4  (via drill 0.2)
  Top 0.152: U5.37 25.05,7.98 25.11,8.04 25.11,8.06 25.2,8.15 v25.2,8.5
  Bottom 0.152: v25.2,8.5 24.75,8.95 23,8.95 21.95,7.9 21.95,5.61 23.3,4.25 26.16,4.25 26.67,3.73 JP1.8
AREF  (via drill 0.2)
  Top 0.2: v24.68,2.92 24.68,3.36 25.56,4.24 26.2,4.24 26.76,3.68 28.72,3.68 29.07,4.03 29.07,5.52 28.7,5.88 C21.2 28.05,8.13 U5.43
  Top 0.3: JP1.14 11.43,2.08 R3.1
  Bottom 0.2: JP1.14 13.08,2.92 v24.68,2.92
D5  (via drill 0.2)
  Top 0.152: v26.49,19.11 25.6,18.22 25.6,15.01 25.85,14.76 U5.4
  Bottom 0.152: v26.49,19.11 26.7,19.11 27.3,19.71 38.91,19.71 39.6,20.4 39.6,21.36 JP3.10
D6  (via drill 0.2)
  Top 0.152: v25.91,19.14 25.91,18.92 25.32,18.33 25.32,14.88 25.45,14.75 U5.5
  Bottom 0.152: v25.91,19.14 26.31,19.54 26.74,19.54 27.19,19.99 36.14,19.99 36.83,20.68 JP3.9
D9
  Top 0.152: U5.8 24.25,14.74 25.04,15.54 25.04,18.88 25.99,19.82 30.95,19.82 30.97,19.8 33.5,19.8 34.5,20.8 34.5,21.38 JP3.8
D10
  Top 0.152: U5.9 23.85,14.74 24.76,15.65 24.76,18.99 25.87,20.1 30.95,20.1 31.75,20.9 JP3.7
D11
  Top 0.152: U5.11 23.05,15.28 22.93,15.4 22.93,17.56 25.76,20.38 28,20.38 JP3.6
D12
  Top 0.152: U5.12 22.65,17.67 26.57,21.59 JP3.5
D13
  Top 0.152: U5.13 22.25,15 22.37,15.12 22.37,17.79 24.13,19.54 JP3.4
D+  (via drill 0.2)
  Top 0.152: R14.1 31.48,8.3 v32.23,7.55 | J2.A6 7.07,11.68 v7.6,11.15 7.13,10.68 J2.B6
  Bottom 0.152: v32.23,7.55 32.01,7.77 27.53,7.77 25.18,10.12 14.41,10.12 13.93,10.6 8.15,10.6 v7.6,11.15
D-  (via drill 0.2)
  Top 0.152: R13.1 31.86,7.3 v32.26,6.9 | J2.A7 5.77,11.18 v5.3,11.65 v5.31,11.65 5.84,12.18 J2.B7
  Bottom 0.152: v32.26,6.9 31.67,7.49 27.36,7.49 25.01,9.84 14.19,9.84 13.77,10.27 6.68,10.27 v5.3,11.65
EN  (via drill 0.25)
  Top 0.152: R1.2 16.65,17.2 13.29,13.85 v13.29,13.61 | v9.3,9.8 10.25,9.8 11.11,10.66 U2.3
  Top 0.2: JP3.2 19.05,19.3 18.19,18.44 R1.2
  Bottom 0.152: v13.29,13.61 13.05,13.61 12.09,12.64 5.59,12.64 4.85,11.9 4.85,10.65 5.68,9.82 6.35,9.82 6.37,9.8 v9.3,9.8
GND  (via drill 0.2)
  Top 0.2: v21.83,12.91 21.67,13.07 21.67,13.63 21.4,13.91
  other vias: 32.49,15.33 31.03,17.25 31.05,18.12 42.02,18.67 33.31,18.67 34.86,18.67 31.88,18.61 34.37,15.14 35.65,15.1 33.09,11.21 34.36,11.28 35.64,11.29 34.73,12.94 32.67,13.17 36.87,14.92 36.79,12.38 33.7,7.38 32.96,7.54 35.26,4.45 38.57,4.2 38.49,5.16 34.58,5.11 32.26,4.97 32.84,4.19 33.06,2.12 35.49,2.05 30.49,2.33 27.59,2.3 32.29,4.14 29.18,11.62 31.19,11.93 39.4,4.49 27,12.65 21.93,10.7 26.38,9.67 26.14,10.68 21.92,11.64 24.45,12.34 22.82,12.08 22.82,10.9 26.95,12.08 28.6,4.4 27.78,4.4 27.09,4.4 29.58,4.11 31.24,4.11 30.44,4.56 31.29,5.78 24.3,16.88 24.31,18.28 23.41,17.34 26.91,17.32 23.62,20.42 23.09,19.19 21.88,15.72 19.95,16.63 20.28,22.19 22.72,22.27 17.78,22.23 17.89,20.5 26.74,10.22 40.49,13.23 40.49,14.13 40.49,14.78 40.49,11.58 40.49,12.43 42.09,13.23 41.34,13.23 39.74,13.23 38.89,13.23 38.89,14.78 38.89,11.58 42.09,11.58 42.09,14.78 42.09,14.08 42.09,12.43 41.29,11.58 39.69,11.58 38.89,12.43 38.89,14.03 39.64,14.83 41.34,14.83 40.1,3.99 40,4.89 41.05,5.29 41.4,6.89 41.75,7.54 45.4,2.19 41.15,3.09 42.7,2.24 45.55,0.59 43.35,6.59 45.1,2.94 45.65,17.8 46,3.79 46.3,3.09 46.35,2.09 46.35,0.54 45.35,3.64 44.2,2.74 43.4,2.24 44.25,3.49 46.35,13.34 46.35,14.54 46.35,15.74 46.35,16.84 46.35,17.99 46.35,18.99 46.3,20.24 46.35,21.54 46.35,22.34 45.45,22.34 45.5,20.94 44.8,19.69 44.05,19.04 43.65,18.34 44.85,16.64 45.2,15.64 45.65,16.94 45.5,18.79 45.7,14.64 43.5,15.39 38.95,8.69 43.35,22.29 43.4,20.89 43.6,20.14 42.7,19.74 40.75,22.34 40.65,21.24 40.25,20.14 41.25,20.09 38.6,20.19 38.05,22.34 37.55,20.24 38.7,16.89 38.5,16.24 37.4,16.04 37.3,15.39 37.3,14.09 37.35,13.04 37.35,11.89 38,10.84 35.65,12.59 35.65,14.14 18.68,8.9 17.98,9.1 16.58,8.45 18.43,6.6 19.33,5.65 14.88,6.85 14.63,4.5 13.3,5.55 13.3,4.35 10.9,5.3 7.1,5.2 7.05,4.25 10.05,5.2 9.95,4.55 11.2,4.5 3.75,8.95 3.55,8 2.45,8.15 3.05,7.45 17.78,10.7 14.18,11.3 14.38,13.25 14.78,14.15 16.13,16 15.73,14 17.23,16.65 17.33,15.8 17.93,14.1 15.78,19.3 14.83,17.05 13.33,16.3 12.48,19.4 11.13,17.5 11.08,14.9 9.23,15 8.63,13.45 4.18,14.1 4.18,15.1 3.73,15.95 4.63,16.85 6.48,16.85 3.08,14.7 1.98,14.2 3.33,13.35 1.88,13 3.18,12.3 1.83,12.15 3.18,11.3 1.88,10.7 3.08,10 2.68,8.9 1.53,8.6 0.73,8.25 1.18,9.7 0.78,11.1 0.88,13.5 0.73,12.1 0.88,14.5 4.23,22.3 5.83,22.25 6.43,21.35 5.28,20.65 5.08,21.7 9.33,22.1 10.18,20.7 11.13,22.3 12.63,20.65 13.28,22.2 10.23,19.4 7.78,15.7 13.48,17.95 4.33,0.65 5.28,2.5 7.63,0.7 10.03,0.7 11.88,2.9 12.83,0.65 15.18,2.15 15.23,0.55 15.78,3.75 19.93,4.5 21.03,4.4 23.8,13.09 22.9,13.09 21.85,16.44 21.5,15.24 22.35,18.44 19.65,19.84 19.35,18.09 13.93,13.85 15.38,15.15 35.45,22.34 35.35,20.49 32.36,14.65 31.06,14.9 12.13,12.05 12.13,11.55 12.13,11.05 10.13,11.7 9.53,11.7 20.58,6.25 19.58,7.25 17.93,3.4 17.78,2.45 10.18,2 24.44,10.93 25.5,12.34 25.39,0.55 24.79,2.3 25.89,2.5 30.49,0.53 27.99,0.58 33.04,0.58 35.59,0.58 38.14,0.58 38.19,2.58 5.73,6.1 3.98,6.8 4.18,4.45 0.53,3.75 1.48,6.2 7.33,9.15 29.57,13.37 31.12,13.42 27.48,17.47 40.85,2.14 40.1,2.94 39.3,3.64 36.6,3.94 35.55,3.89 36.55,5.29 34.85,6.34 37.1,7.04 36.94,10.89 21.48,3.4 28.19,4.15 22.98,9.4 24.83,9.4 11.05,6.4 9.75,6.5 7.45,6.85 46.35,9.14 46.35,8.34 46.35,7.64 46.35,6.94 46.3,5.34 46.2,4.54 44.7,5.49 44.65,6.49 44.65,7.29 44.05,5.84 44.15,6.84 44.65,8.64 44.65,9.24 44.65,9.94 44.2,11.14 43.6,11.14 43.65,10.64 44,9.89 46.35,9.94 46.35,10.69 46.35,11.54 46.35,12.39 45.7,12.59 44.85,12.59 45.8,11.99 29.43,16.85 28.58,14.7 27.58,14.8 29.38,18.3
  pour Top (no thermals): 0,22.86 0,0 46.48,0 46.48,22.86
  pour Bottom: 46.48,0 0,0 0,22.86 46.48,22.86
  cutout Top: 42.5,5.4 arc-90 43.4,4.5 43.4,4.4 arc-90 42.52,3.52 arc-90 41.58,4.47 arc-90
I2C0_SCL  (via drill 0.2)
  Top 0.152: U5.3 26.25,14.76 26.07,14.93 26.07,18.08 v26.47,18.48
  Bottom 0.152: v26.47,18.48 27.42,19.43 41.53,19.43 41.91,19.81 JP3.11
I2C0_SDA  (via drill 0.2)
  Top 0.152: U5.2 26.65,14.75 26.35,15.05 26.35,17.75 v27.05,18.45
  Bottom 0.152: v27.05,18.45 27.75,19.15 43.5,19.15 44.45,20.1 JP3.12
LED  (via drill 0.2, 0.25)
  Top 0.152: U5.15 21.02,17 21.86,17.84 v21.86,19.98 | v13.4,19.95 10,19.95 8.9,18.85 6.95,18.85 6.7,19.1 6.7,19.45 6.35,19.8 R7.1
  Bottom 0.152: v21.86,19.98 20.96,19.98 20.62,20.32 18.32,20.32 17.95,19.95 v13.4,19.95
N$1
  Top 0.2: CHG.C 4.52,5.39 5.14,4.77 R2.1
N$2
  Top 0.152: R7.2 5.19,19.75 3.31,17.87 L.A
N$3
  Top 0.152: R2.2 6.6,3.47 14.54,3.47 15.26,4.19 15.26,6.11 15.89,6.74 U3.1
N$4
  Top 0.2: R8.1 17.57,5.84 16.48,4.75 U3.5
N$5
  Top 0.152: U5.46 28.39,9.5 29.4,8.49 29.4,7.45 29.55,7.3 R13.2
N$6
  Top 0.152: R4.1 41.78,10.77 U4.31
N$7
  Top 0.152: U5.47 28.39,9.9 29.94,8.35 R14.2
N$8
  Top 0.152: U4.27 39.75,9.74 39.92,9.57 39.92,8.77 39.87,8.73 39.87,7.53 39.23,6.89 Q2.1 39.44,6.65 C10.1
N$9  (via drill 0.25)
  Top 0.152: U4.14 39.75,16.36 v39.7,16.4
  Top 0.2: v43.41,16.12 44.55,17.26 TP3.TP
  Bottom 0.2: v39.7,16.4 41.42,16.4 41.85,16.83 42.71,16.83 v43.41,16.12
N$10
  Top 0.152: U4.28 40.25,9.33 C11.1 40.41,8.28 Q2.3
N$11
  Top 0.2: J2.B5 7.92,9.68 R10.1
N$12
  Top 0.2: J2.A5 7.92,12.68 R12.2
N$13
  Top 0.152: U5.20 20.45,11.5 20,11.95 20,14.5 19.65,14.85 Q1.3 19.18,14.98 C2.1
N$14  (via drill 0.2)
  Top 0.152: U5.24 21.82,9.9 v22.31,9.41
  Bottom 0.152: TP1.P$1 15.37,5.54 17.92,8.1 20.21,8.1 21.53,9.42 v22.3,9.42 v22.31,9.41
N$15  (via drill 0.2)
  Top 0.152: U5.25 21.38,9.5 v21.89,8.99
  Bottom 0.152: v21.89,8.99 21.5,8.99 20.33,7.82 18.25,7.82 17.91,7.48 TP2.P$1
N$16
  Top 0.152: R5.2 17.65,11.7 16.85,12.5 Q1.1 15.7,13.25
  Top 0.254: C4.1 15.51,13.25 15.7,13.25
N$17
  Top 0.152: U5.21 20.4,11.1 19.8,11.7 R5.1
N$18  (via drill 0.2)
  Top 0.152: C20.2 29.96,11.27 29.8,11.1 | C19.2 19.34,9.21 v19.35,9.2 | U5.45 28.4,9.1 29.12,8.38 29.12,6.63 29.45,6.3 C5.2 30.07,6.2 v30.3,6.2
  Top 0.2: 29.8,11.1 U5.50 27.48,11.1 27.22,10.84 27.22,9.37 27.49,9.1 U5.45 | U5.23 20.55,10.3 19.95,9.7 C19.2
  Top 0.3: v22.7,6.25 21.3,6.25 19.34,8.21 19.34,9.21
  Bottom 0.3: v30.3,6.2 27.32,6.2 22.75,6.2 v22.7,6.25
N$19
  Top 0.75: R18.2 arc-90 44.79,4.45 J1.P$3
N$20  (via drill 0.25)
  Top 0.2: R1.1 20.18,17.2 v20.55,17.57
  Top 0.5: v11.15,13.1 11.13,13.08 U2.1 9.52,12.56 C6.1 9.35,12.55 8.65,11.85 8.65,8.75 Q11.3 | v20.55,17.57 D1.C
  Bottom 0.5: v11.15,13.1 11.9,13.1 16.12,17.32 20.3,17.32 v20.55,17.57
N$21
  Top 0.7: 48.72,6.17 arc90 49.45,6.9 49.45,7.38 arc90 ANT1.1
  Top 0.75: R19.1 48.72,6.17
N$123
  Top 0.152: U4.13 40.23,15.62 R11.1
NEOPIXEL
  Top 0.152: U5.14 21.85,13.94 22.1,13.69 23.96,13.69 24.85,12.8 26.43,12.8 28.05,14.42 28.05,16.25 30.44,18.64 LED1.1
QSPI_SCLK
  Top 0.152: U5.52 28.39,11.9 29.13,12.64 31.55,12.64 31.95,12.24 31.95,8.65 32.1,8.5 33.4,8.5 33.72,8.82 U1.6
QSPI_SD0
  Top 0.152: U5.53 28.39,12.3 29.02,12.92 31.7,12.92 32.35,12.27 32.35,9.97 U1.5
QSPI_SD1
  Top 0.152: U5.55 28.25,13.1 29.33,14.18 32.88,14.18 33.1,14.4 33.1,17.65 33.35,17.9 34.75,17.9 34.99,17.66 U1.2
QSPI_SD2
  Top 0.152: U5.54 28.25,12.7 29.45,13.9 33.3,13.9 33.72,14.32 U1.3
QSPI_SD3
  Top 0.152: U5.51 28.38,11.5 29.25,12.36 31.41,12.36 31.67,12.1 31.67,8.53 31.98,8.22 34.47,8.22 34.99,8.74 U1.7
RF1
  Top 0.3: U4.2 43.55,11.95
  Top 0.75: 43.55,11.95 44.05,11.95 arc-90 Z2.2 Z3.2
RF2
  Top 0.6: R18.1 R19.2
  Top 0.75: Z3.1 Z1.2 R18.1
RP2040_RXD  (via drill 0.2)
  Top 0.152: v38.38,6.3 38.5,6.42 38.5,9.75 39.25,10.5 U4.26 | U5.7 24.65,13.7 25.12,13.23 v25.75,13.23
  Bottom 0.152: v25.75,13.23 25.97,13.01 25.97,11.93 29.46,8.44 33.84,8.44 36.02,6.27 38.33,6.27 38.34,6.26 v38.38,6.3
RP2040_TXD  (via drill 0.2)
  Top 0.152: v38.05,7.2 38.15,7.3 38.15,10 38.75,10.6 U4.25 | U5.6 25.05,13.85 25.24,13.66 25.93,13.66 26.04,13.55 v26.25,13.55
  Bottom 0.152: v26.25,13.55 26.25,12.05 29.58,8.72 33.96,8.72 36.13,6.55 37.7,6.55 38.05,6.9 v38.05,7.2
RX  (via drill 0.2)
  Top 0.152: U5.28 21.07,8.25 21.07,7.37 v21,7.3 | v25.5,3.35 25.75,3.1 38.65,3.1 39.37,2.38 JP1.3
  Bottom 0.152: v21,7.3 21,6.65 21.35,6.3 21.35,5.4 23.25,3.5 25.35,3.5 v25.5,3.35
SCK  (via drill 0.2)
  Top 0.152: U5.34 23.85,8.05 v23.5,8.4
  Bottom 0.152: JP1.6 31.75,5.95 30.79,6.91 30.01,6.91 29.96,6.86 24.94,6.86 23.5,8.3 v23.5,8.4
SDI  (via drill 0.2)
  Top 0.152: JP1.4 36.83,2.37 36.38,2.82 31.35,2.82 31.32,2.79 v31.32,2.67 | v22.7,6.84 22.65,6.89 U5.31
  Bottom 0.152: v31.32,2.67 31.32,3.42 30.81,3.93 30.81,4.32 30.88,4.39 30.88,5.54 30.73,5.69 30.73,6.38 30.48,6.63 30.12,6.63 30.07,6.58 23.01,6.58 22.75,6.84 v22.7,6.84
SDO  (via drill 0.2)
  Top 0.152: U5.35 24.25,8.4 v24.15,8.5
  Bottom 0.152: v24.15,8.5 24.25,8.4 24.25,8 25.11,7.14 29.84,7.14 29.89,7.19 30.96,7.19 34.29,3.85 JP1.5
SLEEP
  Top 0.2: U4.8 R9.2
TX  (via drill 0.2)
  Top 0.152: U5.27 21.5,8.7 21.75,8.45 21.75,8.15 21.43,7.83 v21.43,6.85 | v25.95,3.78 26.35,3.38 38.82,3.38 40.93,1.27 JP1.2
  Bottom 0.152: v21.43,6.85 21.63,6.65 21.63,5.51 23.36,3.78 v25.95,3.78
VBAT  (via drill 0.35)
  Top 0.5: U3.3 13.99,8.62 C3.1 13.78,9.2 Q11.2 11.4,9.2 12.75,10.55 12.75,12.45 12.2,13 X1.2 12.2,16.2 v13.05,17.05
  Bottom 0.5: v13.05,17.05 11.75,18.35 11.75,20.95 12.39,21.59 JP3.1
VBUS  (via drill 0.2, 0.25, 0.35)
  Top 0.152: 9.18,18.23 8.83,18.57 6.83,18.57 6.61,18.8 R17.1
  Top 0.2: CHG.A 4.4,7.97 4.4,9.85
  Top 0.3: J2.B4/A9 5.72,9.03 5.33,9.42 4.8,9.42 | 4.87,13.48 4.98,13.59 5.48,13.59 5.72,13.83 J2.A4/B9
  Top 0.5: J2.A4/B9 6.99,13.83 8.85,15.69 8.85,17.9 9.18,18.23 9.6,18.65 16.76,18.65 D1.A 17.26,19.15 v17.85,19.15 | 4.87,13.48 4.4,13.01 4.4,9.85 4.4,9.82 v4.71,9.51 4.8,9.42 | v7.71,7.82 7.71,7.8 8.25,7.26 11.31,7.26 Q11.1 12.55,7.3 13.99,5.86 U3.4
  Bottom 0.5: v7.71,7.82 6.16,9.37 4.85,9.37 v4.71,9.51 | v17.85,19.15 22.05,19.15 22.6,19.7 22.6,20.58 JP3.3
WIFI_BOOT  (via drill 0.2)
  Top 0.152: U5.16 20.55,13.1 20.38,13.27 20.38,15.68 v20.4,15.7 | U4.15 39.25,18.25 v39.1,18.4
  Bottom 0.152: v20.4,15.7 23.41,18.71 25.63,18.71 26.32,18.02 27.23,18.02 28.08,18.87 31.01,18.87 31.84,18.04 36.9,18.04 37.26,18.4 v39.1,18.4

### Text on the board
tPlace: BAT | En | USB | 13 | 12 | 11 | ~ | 10 | ~ | 9 | ~ | 6 | ~5 | SCL | SDA | #8 | CHG | RESET | BOOT | ANT | RST | ARf | GND | A0 | A1 | A2 | A3 | A4 | A5 | SCK | SDO | SDI | RX | TX | GND | 3V
bPlace: 4.2V / Li-Po Battery / USB charge | BAT | En | USB | 13 | 12 | 11~ | 10~ | 9~ | 6 | 5~ | SCL | SDA | Model: 2040 | swclk | swdio | RST | 3V | ARf | GND | A0 | A1 | A2 | A3 | A4 | A5 | SCK | SDO | SDI | RX | TX | GND
Instructions: No TABS here